# EAGLE design FIFOv3 (EAGLE 9.6.2)
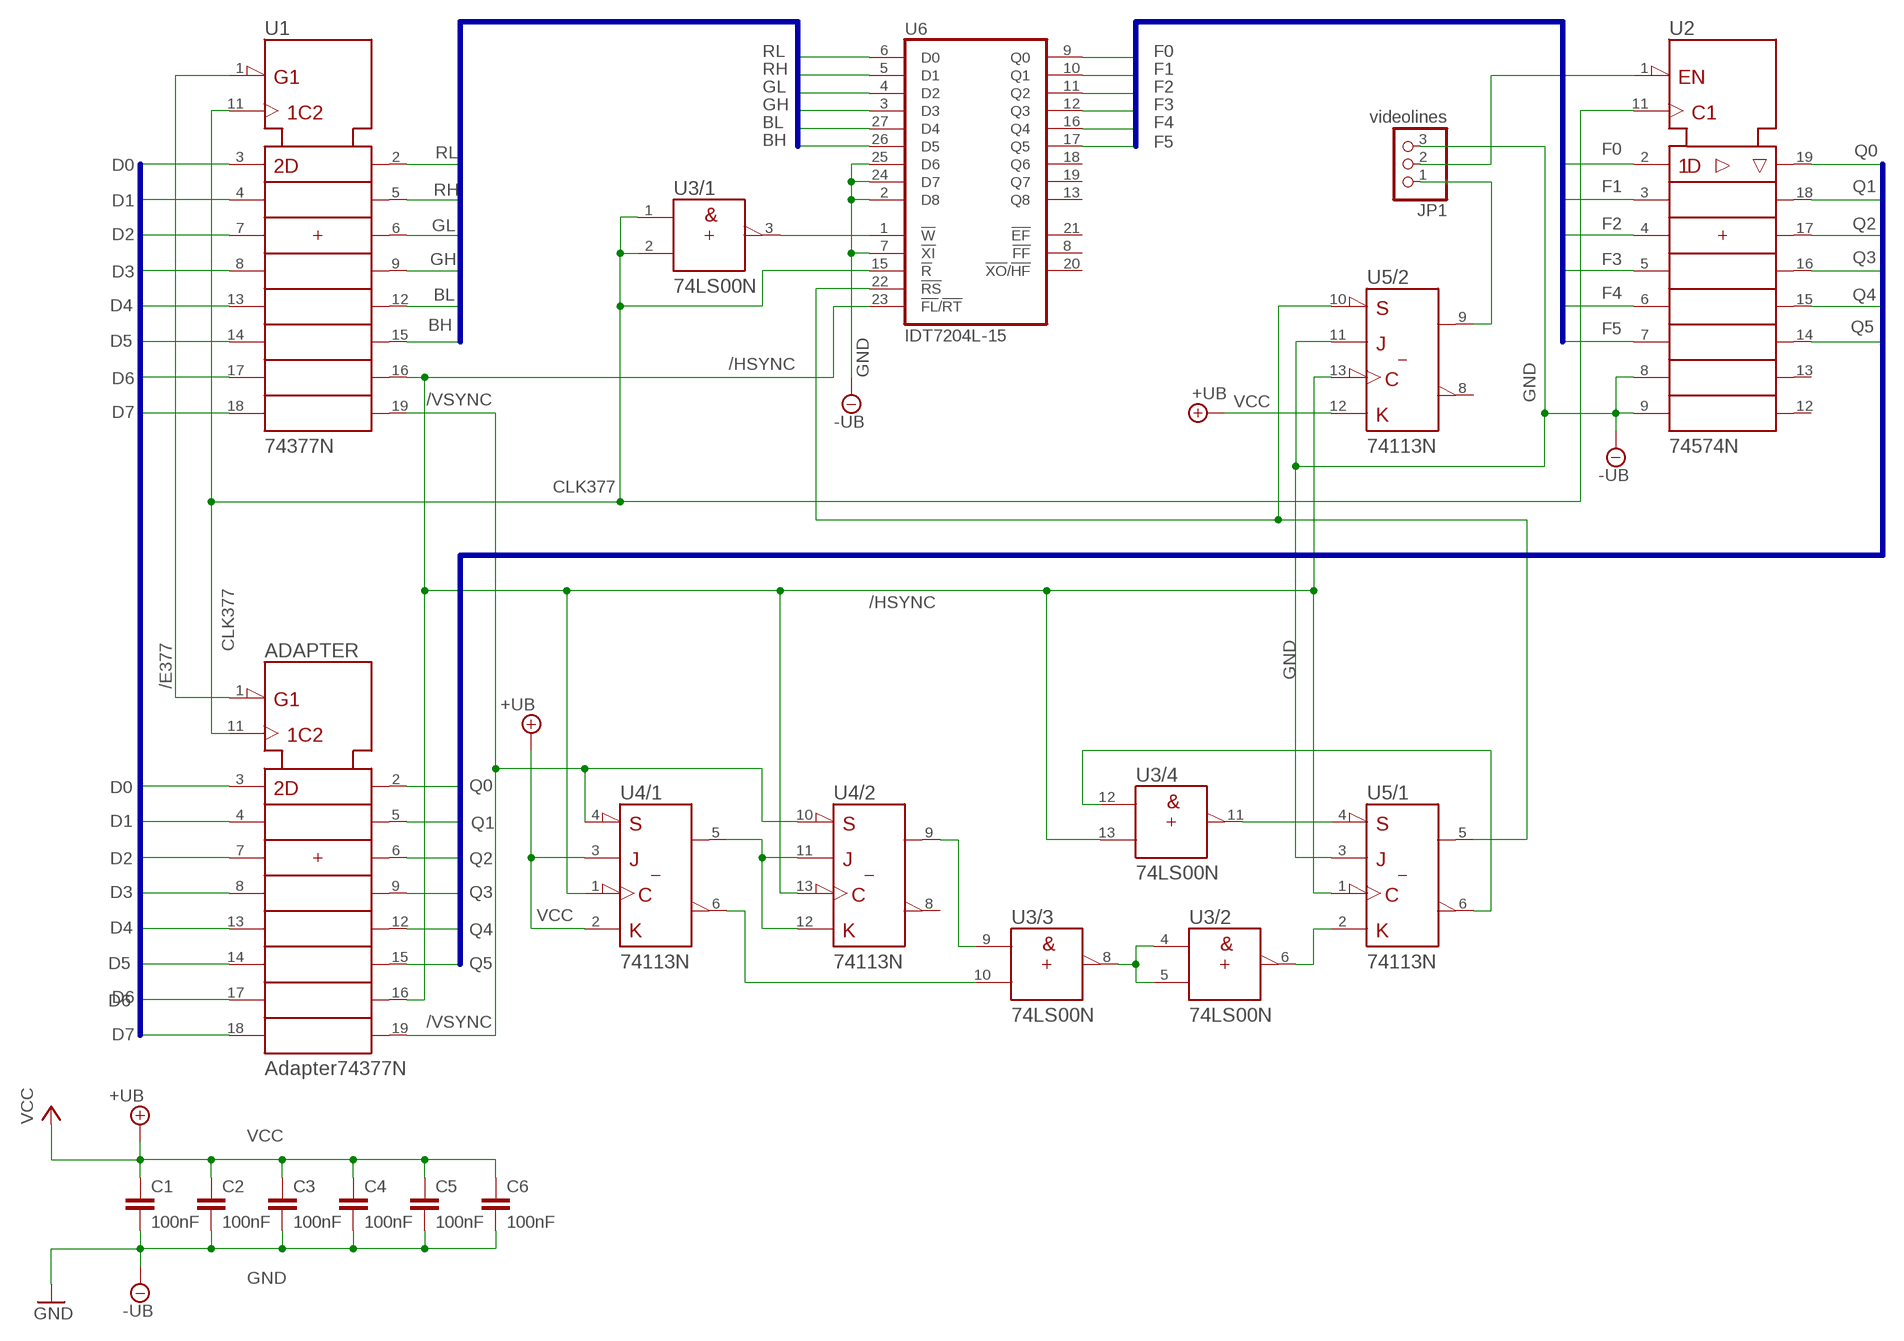
[diagram p0: schematic, sheet 1]

## Parts
ADAPTER  Adapter74377N  74377N  [DIL20]
C1  100nF  C5/2.5  [C5B2.5]
C2  100nF  C5/2.5  [C5B2.5]
C3  100nF  C5/2.5  [C5B2.5]
C4  100nF  C5/2.5  [C5B2.5]
C5  100nF  C5/2.5  [C5B2.5]
C6  100nF  C5/2.5  [C5B2.5]
JP1  videolines  PINHD-1X3  [1X03]
U1  74377N  [DIL20]
U2  74574N  [DIL20]
U3  74LS00N  [DIL14]
U4  74113N  [DIL14]
U5  74113N  [DIL14]
U6  IDT7204L-15  7203PDIL28-3  [DIL28-3]

## Nets
/E377: ADAPTER.1(!G) U1.1(!G)
/HSYNC: ADAPTER.16(7Q) U1.16(7Q) U3.13(/4:B) U4.1(/1:CLK) U4.13(/2:CLK) U5.1(/1:CLK) U5.13(/2:CLK) U6.23(!FL!/!RT)
/VSYNC: ADAPTER.19(8Q) U1.19(8Q) U4.4(/1:!PRE) U4.10(/2:!PRE)
BH: U1.15(6Q) U6.26(D5)
BL: U1.12(5Q) U6.27(D4)
CLK377: ADAPTER.11(CLK) U1.11(CLK) U2.11(CLK) U3.1(/1:A) U3.2(/1:B) U6.15(!R)
D0: ADAPTER.3(1D) U1.3(1D)
D1: ADAPTER.4(2D) U1.4(2D)
D2: ADAPTER.7(3D) U1.7(3D)
D3: ADAPTER.8(4D) U1.8(4D)
D4: ADAPTER.13(5D) U1.13(5D)
D5: ADAPTER.14(6D) U1.14(6D)
D6: ADAPTER.17(7D) U1.17(7D)
D7: ADAPTER.18(8D) U1.18(8D)
F0: U2.2(1D) U6.9(Q0)
F1: U2.3(2D) U6.10(Q1)
F2: U2.4(3D) U6.11(Q2)
F3: U2.5(4D) U6.12(Q3)
F4: U2.6(5D) U6.16(Q4)
F5: U2.7(6D) U6.17(Q5)
GH: U1.9(4Q) U6.3(D3)
GL: U1.6(3Q) U6.4(D2)
GND: C1.2 C2.2 C3.2 C4.2 C5.2 C6.2 JP1.3 U2.8(7D) U2.9(8D) U5.3(/1:J) U5.11(/2:J) U6.2(D8) U6.7(!XI) U6.24(D7) U6.25(D6) ; supply symbol labelled -UB
N$1: U4.5(/1:Q) U4.11(/2:J) U4.12(/2:K)
N$2: U3.3(/1:Y) U6.1(!W)
N$3: U3.10(/3:B) U4.6(/1:!Q)
N$4: U3.9(/3:A) U4.9(/2:Q)
N$6: U3.4(/2:A) U3.5(/2:B) U3.8(/3:Y)
N$7: U3.6(/2:Y) U5.2(/1:K)
N$8: U3.11(/4:Y) U5.4(/1:!PRE)
N$9: U3.12(/4:A) U5.6(/1:!Q)
N$10: JP1.1 U5.9(/2:Q)
N$11: JP1.2 U2.1(!OC)
N$12: U5.5(/1:Q) U5.10(/2:!PRE) U6.22(!RS)
Q0: ADAPTER.2(1Q) U2.19(1Q)
Q1: ADAPTER.5(2Q) U2.18(2Q)
Q2: ADAPTER.6(3Q) U2.17(3Q)
Q3: ADAPTER.9(4Q) U2.16(4Q)
Q4: ADAPTER.12(5Q) U2.15(5Q)
Q5: ADAPTER.15(6Q) U2.14(6Q)
RH: U1.5(2Q) U6.5(D1)
RL: U1.2(1Q) U6.6(D0)
VCC: C1.1 C2.1 C3.1 C4.1 C5.1 C6.1 U4.2(/1:K) U4.3(/1:J) U5.12(/2:K) ; supply symbol labelled +UB
Unconnected: U2.12(8Q) U2.13(7Q) U4.8(/2:!Q) U5.8(/2:!Q) U6.8(!FF) U6.13(Q8) U6.18(Q6) U6.19(Q7) U6.20(!XO!/!HF) U6.21(!EF)

## Buses
D0,D1,D2,D3,D4,D5,D6,D7
BH,BL,GH,GL,RH,RL
F0,F1,F2,F3,F4,F5
Q0,Q1,Q2,Q3,Q4,Q5

## Power pins joined to a net without a drawn wire
GND: ADAPTER.10(-UB) U1.10(-UB) U2.10(-UB) U3.7(/-UB:-UB) U4.7(/-UB:-UB) U5.7(/-UB:-UB) U6.14(GND)
VCC: ADAPTER.20(+UB) U1.20(+UB) U2.20(+UB) U3.14(/+UB:+UB) U4.14(/+UB:+UB) U5.14(/+UB:+UB) U6.28(VCC)

## Library data of the parts
ADAPTER U1 = 74ttl-din:74*377: Octal D type FLIP FLOP, enable
C1-C6 = capacitor-wima:C: CAPACITOR naming: grid - package width
JP1 = pinhead:PINHD-1X3: PIN HEADER
U2 = 74ttl-din:74*574: 8-bit D type FLIP FLOP bus driver
U3 = 74ttl-din:74*00: Quad 2-input NAND gate
U4 U5 = 74ttl-din:74*113: Dual J-K negative edge triggered FLIP FLOP, preset
U6 = memory-idt:7203P: MEMORY

## Board
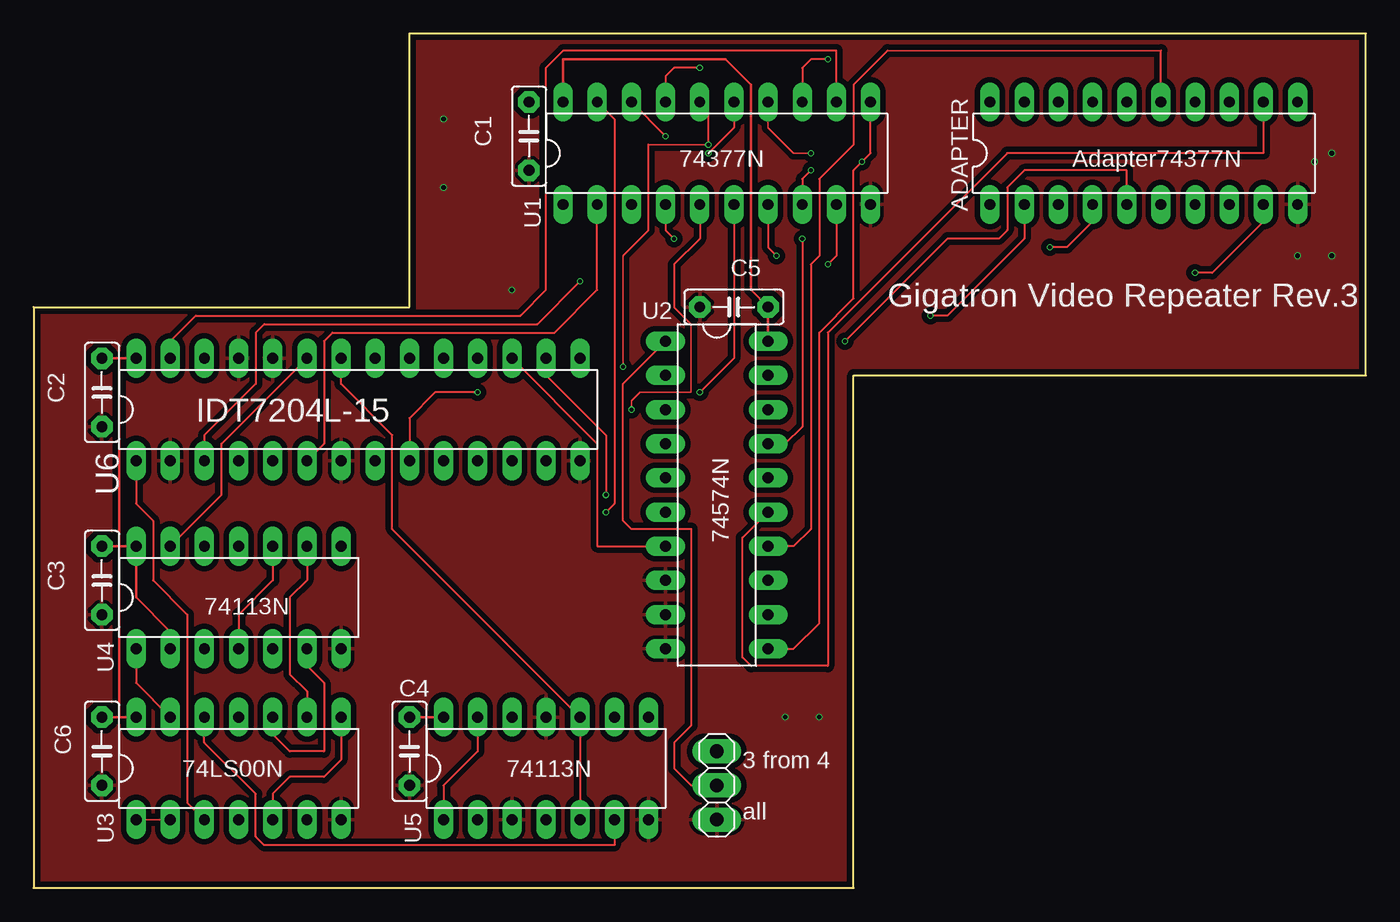
[diagram p1: board, top side]
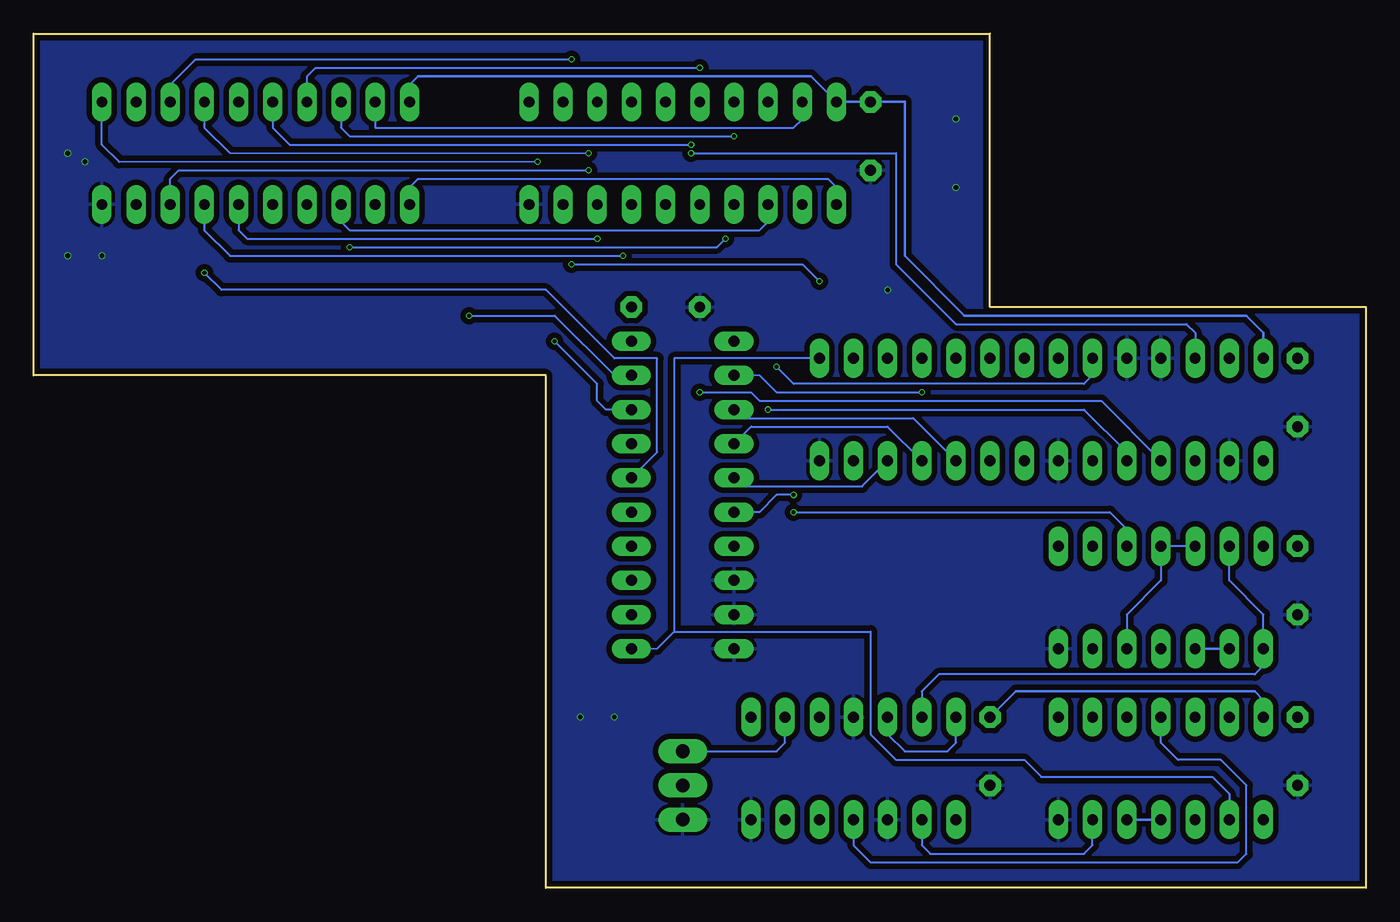
[diagram p2: board, bottom side, seen from below]

Size 99.06 x 63.5 mm. Coordinates in mm from the lower left corner, seen from the top.
Outline: 0,0 60.96,0 60.96,38.1 99.06,38.1 99.06,63.5 27.94,63.5 27.94,43.18 0,43.18 0,0
Copper layers (1*16): Top 0.035mm / dielectric 1.6mm / Bottom 0.035mm
Design rules "jlcpcb-2layers": minimum track width 5mil, minimum drill 0.3mm, track to track 5mil, track to pad 5mil, pad to pad 5mil, via to via 5mil, smd to smd 5mil, copper to edge 0.2mm, drill to drill 6mil, minimum pad ring 10mil, minimum via ring 3mil, stop-mask expansion 4mil, vias tented up to drill 0mil, thermal gap 10mil

### Footprints (pad centres in the part's own frame; a part is rotated, then mirrored left to right if it is on the bottom)
DIL20 = drill 0.813 long: 1 -11.43,-3.81; 2 -8.89,-3.81; 3 -6.35,-3.81; 4 -3.81,-3.81; 5 -1.27,-3.81; 6 1.27,-3.81; 7 3.81,-3.81; 8 6.35,-3.81; 9 8.89,-3.81; 10 11.43,-3.81; 11 11.43,3.81; 12 8.89,3.81; 13 6.35,3.81; 14 3.81,3.81; 15 1.27,3.81; 16 -1.27,3.81; 17 -3.81,3.81; 18 -6.35,3.81; 19 -8.89,3.81; 20 -11.43,3.81
C5B2.5 = drill 0.813 pad 1.6 octagon: 1 -2.54,0; 2 2.54,0
1X03 = drill 1.016 long: 1 -2.54,0; 2 0,0; 3 2.54,0
DIL14 = drill 0.813 long: 1 -7.62,-3.81; 2 -5.08,-3.81; 3 -2.54,-3.81; 4 0,-3.81; 5 2.54,-3.81; 6 5.08,-3.81; 7 7.62,-3.81; 8 7.62,3.81; 9 5.08,3.81; 10 2.54,3.81; 11 0,3.81; 12 -2.54,3.81; 13 -5.08,3.81; 14 -7.62,3.81
DIL28-3 = drill 0.813 long: 1 -16.51,-3.81; 2 -13.97,-3.81; 3 -11.43,-3.81; 4 -8.89,-3.81; 5 -6.35,-3.81; 6 -3.81,-3.81; 7 -1.27,-3.81; 8 1.27,-3.81; 9 3.81,-3.81; 10 6.35,-3.81; 11 8.89,-3.81; 12 11.43,-3.81; 13 13.97,-3.81; 14 16.51,-3.81; 15 16.51,3.81; 16 13.97,3.81; 17 11.43,3.81; 18 8.89,3.81; 19 6.35,3.81; 20 3.81,3.81; 21 1.27,3.81; 22 -1.27,3.81; 23 -3.81,3.81; 24 -6.35,3.81; 25 -8.89,3.81; 26 -11.43,3.81; 27 -13.97,3.81; 28 -16.51,3.81

### Placement (x,y rotation side)
ADAPTER  82.55,54.61 0 top
C1  36.83,55.88 270 top
C2  5.08,36.83 270 top
C3  5.08,22.86 270 top
C4  27.94,10.16 270 top
C5  52.07,43.18 180 top
C6  5.08,10.16 270 top
JP1  50.8,7.62 270 top
U1  50.8,54.61 0 top
U2  50.8,29.21 270 top
U3  15.24,8.89 0 top
U4  15.24,21.59 0 top
U5  38.1,8.89 0 top
U6  24.13,35.56 0 top

### Tracks (layer width: path | path; a pad name or v marks a point on that pad's centre or on a via)
/E377
  Bottom 0.152: U1.1 39.37,52.07 40.01,52.7 70.48,52.7 71.12,52.07 ADAPTER.1
/HSYNC  (via drill 0.3)
  Top 0.127: 45.72,55.24 v50.16,55.24 | 45.72,48.9 43.81,46.99 v43.81,38.73
  Top 0.152: U1.16 50.16,57.78 v50.16,55.24 | U5.1 30.48,7.62 33.02,10.16 U5.13 | U3.13 7.62,15.24 U4.1 | U6.23 13.97,33.02 13.97,29.21 U4.13 | 45.72,48.9 45.72,55.24
  Bottom 0.152: v50.16,55.24 80.01,55.24 81.28,56.52 ADAPTER.16 | U4.13 10.16,22.86 7.62,20.32 U4.1 7.62,16.51 8.26,15.88 31.75,15.88 33.02,14.61 U5.13 | v43.81,38.73 42.55,37.47 20.95,37.47 20.32,38.1 U6.23
/VSYNC  (via drill 0.3)
  Top 0.127: U1.19 43.18,57.15
  Top 0.152: U4.4 15.24,20.32 17.78,22.86 U4.10 | v42.55,27.94 43.18,28.57 43.18,57.15
  Bottom 0.127: 17.78,26.67 U4.10
  Bottom 0.152: U1.19 41.91,57.15 42.55,56.52 73.66,56.52 ADAPTER.19 | 17.78,26.67 19.05,27.94 v42.55,27.94
BH  (via drill 0.3)
  Top 0.152: v50.16,54.61 52.07,56.52 U1.15
  Bottom 0.152: U6.26 12.7,41.27 13.34,41.91 30.48,41.91 34.92,46.35 34.92,54.61 v50.16,54.61
BL
  Top 0.152: U6.27 10.16,40.64 12.06,42.55 36.2,42.55 38.1,44.45 38.1,60.96 39.37,62.23 59.69,62.23 U1.12
CLK377  (via drill 0.3)
  Top 0.127: U3.2 U3.1 | 60.96,53.34 v61.59,53.98
  Top 0.152: U1.11 62.23,54.61 v61.59,53.98 | 60.96,53.34 60.96,43.81 58.42,41.27 58.42,19.68 56.52,17.78 U2.11
  Bottom 0.127: U2.11 52.7,17.78 51.44,19.05 | v61.59,53.98 92.71,53.98
  Bottom 0.152: U6.15 51.44,39.37 51.44,19.05 36.83,19.05 36.83,11.43 34.92,9.53 25.4,9.53 24.13,8.26 11.43,8.26 10.16,6.99 U3.2 | ADAPTER.11 93.98,55.24 92.71,53.98
D0
  Bottom 0.152: U1.3 44.45,49.53 45.09,48.9 75.56,48.9 76.2,49.53 ADAPTER.3
D1  (via drill 0.3)
  Top 0.152: v47.62,48.26 46.99,48.9 U1.4 | ADAPTER.4 78.74,49.53 76.83,47.62 v75.56,47.62
  Bottom 0.152: v47.62,48.26 48.26,47.62 v75.56,47.62
D2  (via drill 0.3)
  Top 0.152: U1.7 54.61,47.62 v55.24,46.99
  Bottom 0.152: v55.24,46.99 84.45,46.99 86.36,48.9 ADAPTER.7
D3  (via drill 0.3)
  Top 0.152: v57.78,53.34 57.15,52.7 U1.8
  Bottom 0.152: v57.78,53.34 88.27,53.34 88.9,52.7 ADAPTER.8
D4  (via drill 0.3)
  Top 0.152: v59.05,61.59 57.78,61.59 57.15,60.96 U1.13
  Bottom 0.127: ADAPTER.13 88.9,59.69
  Bottom 0.152: v59.05,61.59 87,61.59 88.9,59.69
D5  (via drill 0.3)
  Top 0.127: U1.14 54.61,56.52 56.52,54.61 v57.78,54.61
  Bottom 0.127: 84.45,54.61 v57.78,54.61
  Bottom 0.152: ADAPTER.14 86.36,56.52 84.45,54.61
D6  (via drill 0.3)
  Top 0.152: v49.53,60.96 47.62,60.96 46.99,60.33 U1.17
  Bottom 0.152: v49.53,60.96 78.11,60.96 78.74,60.33 ADAPTER.17
D7  (via drill 0.3)
  Top 0.127: v46.99,55.88 U1.18
  Bottom 0.152: v46.99,55.88 75.56,55.88 76.2,56.52 ADAPTER.18
F0  (via drill 0.3)
  Top 0.152: v33.02,36.83 29.84,36.83 27.94,34.92 U6.9
  Bottom 0.127: U2.2 45.09,38.1
  Bottom 0.152: v33.02,36.83 43.81,36.83 45.09,38.1
F1
  Bottom 0.152: U6.10 33.66,34.92 46.35,34.92 U2.3
F2
  Bottom 0.152: U6.11 35.56,34.29 45.72,34.29 U2.4
F3
  Bottom 0.127: U2.5 46.35,29.84
  Bottom 0.152: U6.12 37.47,29.84 46.35,29.84
F4  (via drill 0.3)
  Top 0.127: U6.16 38.1,38.1
  Top 0.152: v42.55,29.21 42.55,33.66 38.1,38.1
  Bottom 0.152: U2.6 45.09,27.94 43.81,29.21 v42.55,29.21
F5
  Top 0.152: U2.7 41.91,25.4 41.91,33.02 U6.17
GH  (via drill 0.3)
  Top 0.152: U6.3 12.7,33.66 16.51,37.47 16.51,41.27 17.14,41.91 37.47,41.91 v40.64,45.09 | v59.05,46.35 59.69,46.99 U1.9
  Bottom 0.152: v40.64,45.09 41.91,46.35 v59.05,46.35
GL  (via drill 0.3)
  Top 0.152: v49.53,36.83 52.07,39.37 U1.6
  Bottom 0.152: U6.4 19.68,36.2 45.09,36.2 45.72,36.83 v49.53,36.83
GND  (via drill 0.35)
  other vias: 95.25,53.98 96.52,54.61 96.52,46.99 93.98,46.99 35.56,44.45 30.48,52.07 30.48,57.15 58.42,12.7 55.88,12.7
  pour Top (isolate 0.406): 0,43.18 27.94,43.18 27.94,63.5 99.06,63.5 99.06,38.1 60.96,38.1 60.96,0 0,0
  pour Bottom (isolate 0.406): 0,43.18 27.94,43.18 27.94,63.5 99.06,63.5 99.06,38.1 60.96,38.1 60.96,0 0,0
N$1
  Bottom 0.152: U4.5 17.78,20.32 15.24,22.86 U4.11 U4.12
N$2
  Top 0.152: U3.3 11.43,6.35 11.43,20.32 8.89,22.86 8.89,27.3 7.62,28.57 U6.1
N$3
  Top 0.127: 17.78,11.43 U3.10 | U4.6 20.32,16.51
  Top 0.152: 17.78,11.43 19.05,10.16 21.59,10.16 21.59,15.24 20.32,16.51
N$4
  Top 0.152: U3.9 20.32,14.61 19.05,15.88 19.05,21.59 20.32,22.86 U4.9
N$6
  Top 0.152: U3.8 22.86,9.53 21.59,8.26 19.05,8.26 17.78,6.99 U3.5
  Bottom 0.203: U3.5 U3.4
N$7
  Bottom 0.152: U3.6 20.32,3.17 20.95,2.54 32.38,2.54 33.02,3.17 U5.2
N$8
  Bottom 0.152: U5.4 38.1,3.17 36.83,1.91 9.53,1.91 8.89,2.54 8.89,7.62 10.79,9.53 13.97,9.53 15.24,10.79 U3.11
N$9
  Top 0.152: U3.12 12.7,10.79 16.51,6.99 16.51,3.81 17.14,3.17 43.18,3.17 U5.6
N$10
  Bottom 0.152: U5.9 43.18,10.79 43.81,10.16 JP1.1
N$11
  Top 0.152: U2.1 43.81,37.47 43.81,27.3 44.45,26.67 48.9,26.67 48.9,12.06 47.62,10.79 47.62,8.89 48.9,7.62 JP1.2
N$12
  Top 0.152: U5.5 U5.10 26.67,26.67 26.67,33.66 22.86,37.47 U6.22
Q0  (via drill 0.3)
  Top 0.152: v66.67,42.55 67.94,42.55 73.66,48.26 ADAPTER.2
  Bottom 0.152: U2.19 55.88,38.1 60.33,42.55 v66.67,42.55
Q1  (via drill 0.3)
  Top 0.152: ADAPTER.5 81.28,53.34 73.66,53.34 72.39,52.07 72.39,48.9 71.75,48.26 67.94,48.26 v60.33,40.64
  Bottom 0.152: U2.18 56.52,35.56 57.15,36.2 57.15,37.47 v60.33,40.64
Q2  (via drill 0.3)
  Top 0.152: U2.17 55.88,33.02 57.15,34.29 v57.15,48.26
  Bottom 0.152: v57.15,48.26 83.19,48.26 83.82,48.9 ADAPTER.6
Q3  (via drill 0.3)
  Top 0.152: ADAPTER.9 91.44,49.53 87.63,45.72 v86.36,45.72
  Bottom 0.152: U2.16 52.7,32.38 52.7,39.37 55.88,39.37 60.96,44.45 85.09,44.45 v86.36,45.72
Q4
  Top 0.152: U2.15 52.7,26.04 52.7,17.14 53.34,16.51 59.05,16.51 59.05,41.27 72.39,54.61 91.44,54.61 ADAPTER.12
Q5
  Top 0.127: 58.42,46.99 57.78,46.35 | 83.82,62.23 63.5,62.23
  Top 0.152: U2.14 56.52,25.4 57.78,26.67 57.78,46.35 | 58.42,46.99 58.42,52.7 60.96,55.24 60.96,59.69 63.5,62.23 | ADAPTER.15 83.82,62.23
RH  (via drill 0.3)
  Top 0.127: v44.45,35.56 44.45,36.2 45.09,36.83 48.9,36.83 48.9,41.91 47.62,43.18
  Top 0.152: 47.62,43.18 47.62,46.35 49.53,48.26 U1.5
  Bottom 0.152: U6.5 17.78,32.38 20.95,35.56 v44.45,35.56
RL
  Top 0.152: U6.6 21.59,33.02 21.59,40.64 22.23,41.27 38.73,41.27 41.91,44.45 U1.2
VCC
  Top 0.203: C2.1 6.35,39.37 | 6.35,39.37 U6.28 | C6.1 6.35,12.7 | 6.35,12.7 U3.14 | C3.1 6.35,25.4 | 6.35,25.4 U4.14 7.62,21.59 10.16,19.05 U4.2 | 6.35,25.4 6.35,12.7 | 6.35,25.4 6.35,39.37 | U2.20 C5.1 53.34,44.45 53.34,59.69 51.44,61.59 39.37,61.59 U1.20 | C4.1 U5.14
  Bottom 0.152: U5.12 35.56,11.43 34.29,10.16 31.11,10.16 30.48,10.79 U5.14
  Bottom 0.203: U4.3 U4.2 | C4.1 26.04,14.61 8.26,14.61 7.62,13.97 U3.14 | ADAPTER.20 71.12,59.69 70.48,60.33 41.27,60.33 U1.20 C1.1 34.29,58.42 34.29,46.99 29.84,42.55 8.89,42.55 7.62,41.27 U6.28

### Text on the board
tPlace: Gigatron Video Repeater Rev.3 | 3 from 4 | all